# Altium project LTC2949.PrjPcb
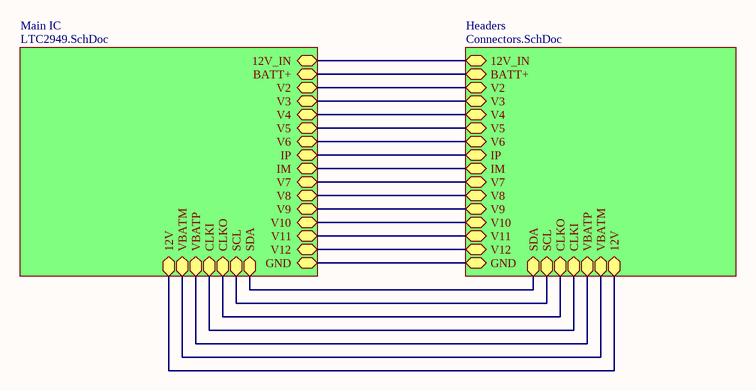
[diagram p0: Main.SchDoc]
3 sheets, 37 parts. Net scope: hierarchical (ports join the sheet entries above them; power ports are global).
Sheets:
  Main.SchDoc
    Main IC = LTC2949.SchDoc
    Headers = Connectors.SchDoc

## Sheet Main.SchDoc
size A

### Sub-sheets
Headers = Connectors.SchDoc: IP (bidir), IM (bidir), V6 (bidir), V5 (bidir), V4 (bidir), V3 (bidir), V2 (bidir), BATT+ (bidir), V7 (bidir), V8 (bidir), V9 (bidir), V10 (bidir), V11 (bidir), V12 (bidir), GND (bidir), SDA (bidir), SCL (bidir), CLKO (bidir), CLKI (bidir), VBATP (bidir), VBATM (bidir), 12V (bidir), 12V_IN (bidir)
Main IC = LTC2949.SchDoc: IP (bidir), IM (bidir), V6 (bidir), V5 (bidir), V4 (bidir), V3 (bidir), V2 (bidir), BATT+ (bidir), V7 (bidir), V8 (bidir), V9 (bidir), V10 (bidir), V11 (bidir), V12 (bidir), GND (bidir), SDA (bidir), SCL (bidir), CLKO (bidir), CLKI (bidir), VBATP (bidir), VBATM (bidir), 12V (bidir), 12V_IN (bidir)

### Nets
AGND: sheet Main IC/VBATM, sheet Headers/VBATM
VBATP: sheet Main IC/VBATP, sheet Headers/VBATP
NetP?#1_1: sheet Main IC/IP, sheet Headers/IP
NetP?#1_2: sheet Main IC/V11, sheet Headers/V11
NetP?#1_3: sheet Main IC/IM, sheet Headers/IM
NetP?#1_4: sheet Main IC/V12, sheet Headers/V12
NetP?#1_5: sheet Main IC/BATT+, sheet Headers/BATT+
NetP?#1_6: sheet Main IC/SDA, sheet Headers/SDA
NetP?#1_7: sheet Main IC/V2, sheet Headers/V2
NetP?#1_8: sheet Main IC/SCL, sheet Headers/SCL
NetP?#1_9: sheet Main IC/V3, sheet Headers/V3
NetP?#1_10: sheet Main IC/CLKO, sheet Headers/CLKO
NetP?#1_11: sheet Main IC/V4, sheet Headers/V4
NetP?#1_12: sheet Main IC/CLKI, sheet Headers/CLKI
NetP?#1_13: sheet Main IC/V5, sheet Headers/V5
NetP?#1_15: sheet Main IC/V6, sheet Headers/V6
NetP?#1_17: sheet Main IC/V7, sheet Headers/V7
NetP?#1_19: sheet Main IC/V8, sheet Headers/V8
NetP?#1_21: sheet Main IC/V9, sheet Headers/V9
NetP?#1_23: sheet Main IC/V10, sheet Headers/V10
(unnamed): sheet Main IC/GND, sheet Headers/GND
(unnamed): sheet Main IC/12V, sheet Headers/12V
(unnamed): sheet Main IC/12V_IN, sheet Headers/12V_IN

## Sheet LTC2949.SchDoc: LTC2949 Test Board
size A4; Author: Leo Xie & Naveela Sookoo; Organization: Waterloop; Address1: 200 University Avenue W; Address2: Engineering 5 ,1104; Address3: Waterloo, Ontario; Address4: N2L 3G1; DocumentNumber: 2; Revision: 1; SheetNumber: 2; SheetTotal: 3
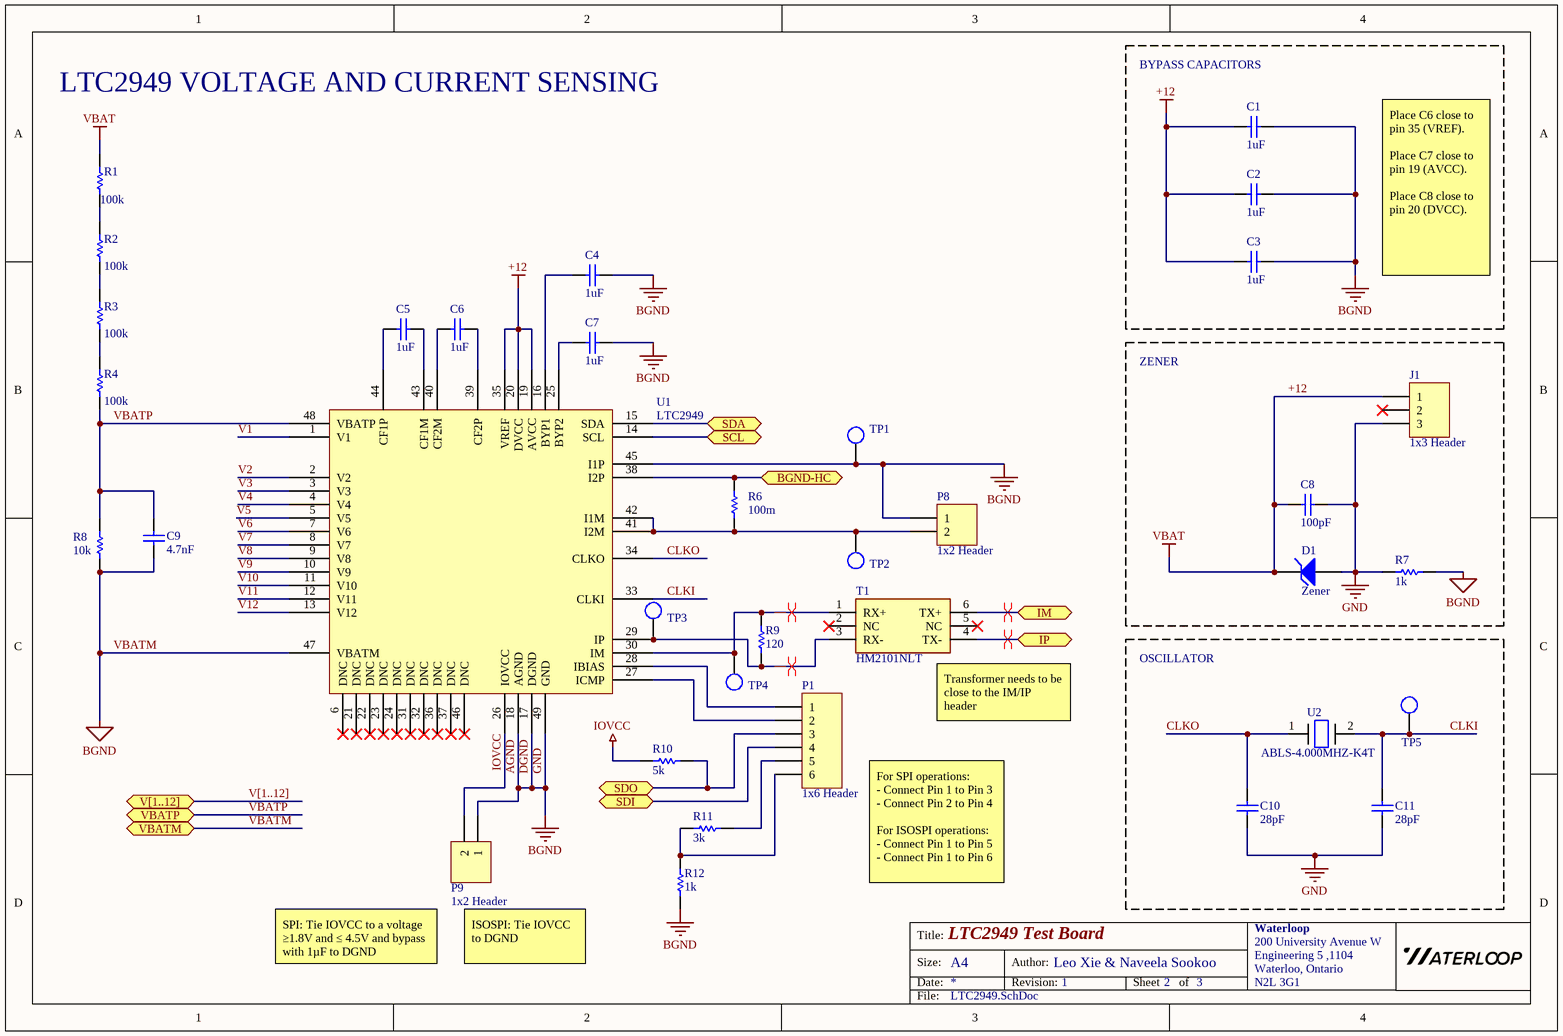
[diagram p1: LTC2949.SchDoc]

### Parts
C1  value 1uF  [0805 - Capacitor]  (hidden comment: Nonpolarized Capacitor)
C2  value 1uF  [0805 - Capacitor]  (hidden comment: Nonpolarized Capacitor)
C3  value 1uF  [0805 - Capacitor]  (hidden comment: Nonpolarized Capacitor)
C4  value 1uF  [0805 - Capacitor]  (hidden comment: Nonpolarized Capacitor)
C5  value 1uF  [0805 - Capacitor]  (hidden comment: Nonpolarized Capacitor)
C6  value 1uF  [0805 - Capacitor]  (hidden comment: Nonpolarized Capacitor)
C7  value 1uF  [0805 - Capacitor]  (hidden comment: Nonpolarized Capacitor)
C8  value 100pF  [0805 - Capacitor]  (hidden comment: Nonpolarized Capacitor)
C9  value 4.7nF  [0805 - Capacitor]  (hidden comment: Nonpolarized Capacitor)
C10  value 28pF  [0805 - Capacitor]  (hidden comment: Nonpolarized Capacitor)
C11  value 28pF  [0805 - Capacitor]  (hidden comment: Nonpolarized Capacitor)
D1  Zener  [SMA - DIODE]
J1  1x3 Header  [HDR1X3]
P1  1x6 Header  [HDR1X6]
P8  1x2 Header  [HDR1X2]
P9  1x2 Header  [HDR1X2]
R1  value 100k  [1206 - Resistor]  (hidden comment: Resistor)
R2  value 100k  [1206 - Resistor]  (hidden comment: Resistor)
R3  value 100k  [1206 - Resistor]  (hidden comment: Resistor)
R4  value 100k  [1206 - Resistor]  (hidden comment: Resistor)
R6  value 100m  [0603 - Resistor]  (hidden comment: Resistor)
R7  value 1k  [0603 - Resistor]  (hidden comment: Resistor)
R8  value 10k  [0805 - Resistor]  (hidden comment: Resistor)
R9  value 120  [0603 - Resistor]  (hidden comment: Resistor)
R10  value 5k  [0603 - Resistor]  (hidden comment: Resistor)
R11  value 3k  [0603 - Resistor]  (hidden comment: Resistor)
R12  value 1k  [0603 - Resistor]  (hidden comment: Resistor)
T1  HM2101NLT  [HM2101NLT]
TP1  Test Point  [Test Point]  (value not drawn)  (no BOM)
TP2  Test Point  [Test Point]  (value not drawn)  (no BOM)
TP3  Test Point  [Test Point]  (value not drawn)  (no BOM)
TP4  Test Point  [Test Point]  (value not drawn)  (no BOM)
TP5  Test Point  [Test Point]  (value not drawn)  (no BOM)
U1  LTC2949  [LTC2949]
U2  ABLS-4.000MHZ-K4T  [ABLS_4MHZ-K4T]

### Blocks framed on the sheet
BYPASS CAPACITORS: C1-C3
ZENER: C8 D1 J1 R7
OSCILLATOR: C10 C11 TP5 U2

### Ports
BGND-HC (bidir), IM (bidir), IP (bidir), SCL (bidir), SDA (bidir), SDI (bidir), SDO (bidir), V[1..12] (bidir), VBATM (bidir), VBATP (bidir)

### Nets
+12: C1.1 C2.1 C3.1 C8.1 D1.2(K) J1.1 R1.2 U1.19(AVCC) U1.20(DVCC) U1.35(VREF)  [also labelled VBAT]
AGND: C1.2 C2.2 C3.2 C4.2 C7.2 C8.2 C9.1 C10.1 C11.1 D1.1(A) J1.3 P8.1 P9.1 R7.1 R7.2 R8.1 R12.2 TP1.1 U1.17(DGND) U1.18(AGND) U1.45(I1P) U1.47(VBATM) U1.49(GND) ; port VBATM  [also labelled BGND, DGND, GND, VBATM]
IOVCC: P9.2 R10.1 U1.26(IOVCC)
CLKI: C11.2 TP5.1 U1.33(CLKI) U2.2
CLKO: C10.2 U1.34(CLKO) U2.1
V1: U1.1(V1)
V2: U1.2(V2)
V3: U1.3(V3)
V4: U1.4(V4)
V5: U1.5(V5)
V6: U1.7(V6)
V7: U1.8(V7)
V8: U1.9(V8)
V9: U1.10(V9)
V10: U1.11(V10)
V11: U1.12(V11)
V12: U1.13(V12)
VBATP: C9.2 R4.1 R8.2 U1.48(VBATP) ; port VBATP
NetC4_1: C4.1 U1.16(BYP1)
NetC5_1: C5.1 U1.44(CF1P)
NetC5_2: C5.2 U1.43(CF1M)
NetC6_1: C6.1 U1.40(CF2M)
NetC6_2: C6.2 U1.39(CF2P)
NetC7_1: C7.1 U1.25(BYP2)
NetP1_1: P1.1 U1.28(IBIAS)
NetP1_2: P1.2 U1.27(ICMP)
NetP1_3: P1.3 R10.2 ; port SDO
NetP1_4: P1.4 ; port SDI
NetP1_5: P1.5 R11.2
NetP1_6: P1.6 R11.1 R12.1
NetP8_2: P8.2 R6.1 TP2.1 U1.41(I2M) U1.42(I1M)
NetP?#1_1: T1.4(TX-) ; port IP
NetP?#1_3: T1.6(TX+) ; port IM
NetP?#1_6: U1.15(SDA) ; port SDA
NetP?#1_8: U1.14(SCL) ; port SCL
NetR1_1: R1.1 R2.2
NetR2_1: R2.1 R3.2
NetR3_1: R3.1 R4.2
NetR6_2: R6.2 U1.38(I2P) ; port BGND-HC
NetR9_1: R9.1 T1.3(RX-) TP3.1 U1.29(IP)
NetR9_2: R9.2 T1.1(RX+) TP4.1 U1.30(IM)

Not connected (* = marked no-connect by the designer): J1 2*; T1 2(NC)* 5(NC)*; U1 6(DNC)* 21(DNC)* 22(DNC)* 23(DNC)* 24(DNC)* 31(DNC)* 32(DNC)* 36(DNC)* 37(DNC)* 46(DNC)*

### Buses and harness runs
bus V[1..12] = port V[1..12]

### Layout directives
differential pair: NetP?#1_1, NetP?#1_3, NetR9_1, NetR9_2

### Notes on the sheet
- LTC2949 VOLTAGE AND CURRENT SENSING
- Place C6 close to pin 35 (VREF).
  Place C7 close to pin 19 (AVCC).
  Place C8 close to pin 20 (DVCC).
- (near T1) Transformer needs to be close to the IM/IP header
- For SPI operations:
  - Connect Pin 1 to Pin 3
  - Connect Pin 2 to Pin 4
  For ISOSPI operations:
  - Connect Pin 1 to Pin 5
  - Connect Pin 1 to Pin 6
- SPI: Tie IOVCC to a voltage ≥1.8V and ≤ 4.5V and bypass with 1µF to DGND
- ISOSPI: Tie IOVCC to DGND
- Title:
- Size:
- Date:
- A4
- Author:
- Revision:
- Sheet
- of
- File:

### Library data of the parts
C1-C11 = Capacitor - Nonpolarized: Supplier Part Number: *; Supplier: *; Manufacturer: *; Rating: *; Manufacturer Part Number: *
D1 = Zener: Zener Diode; Manufacturer Part Number: *; Manufacturer: *; Supplier: *; Supplier Part Number: *; Value: *
J1 = 1x3 Header: 1x3 Pin Header
P1 = 1x6 Header: 1x6 Pin Header
P8 P9 = 1x2 Header: 1x2 Pin Header
T1 = HM2101NLT: Pulse Transformer 1:1 Surface Mount 150µH, 450µH
U1 = LTC2949: Manufacturer: Analog Devices; Manufacturer Part Number: LTC2949ILXE#3ZZPBF; Supplier: Mouser; Supplier Part Number: 584-2949ILXE3ZZPBF
U2 = ABLS-4.000MHZ-K4T: Crystal Oscillator 4MHz 18pF
R1-R4 R6-R12 = Resistor: Rating: *; Manufacturer Part Number: *; Manufacturer: *; Supplier Part Number: *; Supplier: *

## Sheet Connectors.SchDoc
size A
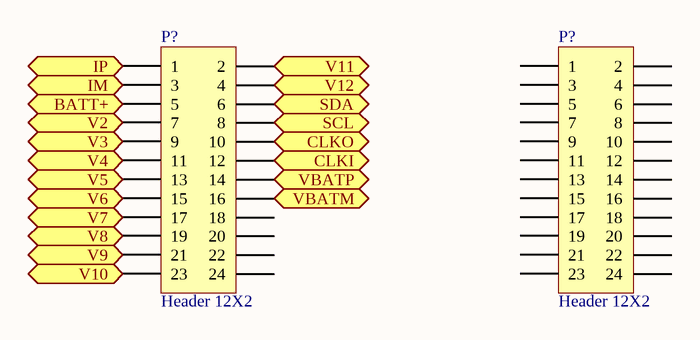
[diagram p2: Connectors.SchDoc]

### Parts
(Parts that share a designator on the sheet are numbered #1, #2 ... from top to bottom, then left to right.)
P?#1  Header 12X2  [HDR2X12]
P?#2  Header 12X2  [HDR2X12]

### Ports
BATT+ (bidir), CLKI (bidir), CLKO (bidir), IM (bidir), IP (bidir), SCL (bidir), SDA (bidir), V2 (bidir), V3 (bidir), V4 (bidir), V5 (bidir), V6 (bidir), V7 (bidir), V8 (bidir), V9 (bidir), V10 (bidir), V11 (bidir), V12 (bidir), VBATM (bidir), VBATP (bidir)

### Nets
AGND: P?#1.16 ; port VBATM
VBATP: P?#1.14 ; port VBATP
NetP?#1_1: P?#1.1 ; port IP
NetP?#1_2: P?#1.2 ; port V11
NetP?#1_3: P?#1.3 ; port IM
NetP?#1_4: P?#1.4 ; port V12
NetP?#1_5: P?#1.5 ; port BATT+
NetP?#1_6: P?#1.6 ; port SDA
NetP?#1_7: P?#1.7 ; port V2
NetP?#1_8: P?#1.8 ; port SCL
NetP?#1_9: P?#1.9 ; port V3
NetP?#1_10: P?#1.10 ; port CLKO
NetP?#1_11: P?#1.11 ; port V4
NetP?#1_12: P?#1.12 ; port CLKI
NetP?#1_13: P?#1.13 ; port V5
NetP?#1_15: P?#1.15 ; port V6
NetP?#1_17: P?#1.17 ; port V7
NetP?#1_19: P?#1.19 ; port V8
NetP?#1_21: P?#1.21 ; port V9
NetP?#1_23: P?#1.23 ; port V10

Not connected (* = marked no-connect by the designer): P?#1 18 20 22 24; P?#2 1 2 3 4 5 6 7 8 9 10 11 12 13 14 15 16 17 18 19 20 21 22 23 24

### Library data of the parts
P?#1 P?#2 = Header 12X2: Header, 12-Pin, Dual row; LatestRevisionDate: 17-Jul-2002; LatestRevisionNote: Re-released for DXP Platform.; Publisher: Altium Limited

## Nets that join several sheets
AGND: LTC2949 (23 pins), Connectors (P?#1.16)
NetP?#1_1: LTC2949 (T1.4), Connectors (P?#1.1)
NetP?#1_3: LTC2949 (T1.6), Connectors (P?#1.3)
NetP?#1_6: LTC2949 (U1.15), Connectors (P?#1.6)
NetP?#1_8: LTC2949 (U1.14), Connectors (P?#1.8)
VBATP: LTC2949 (C9.2 R4.1 R8.2 U1.48), Connectors (P?#1.14)